# EAGLE design TopPCB (EAGLE 9.5.2)
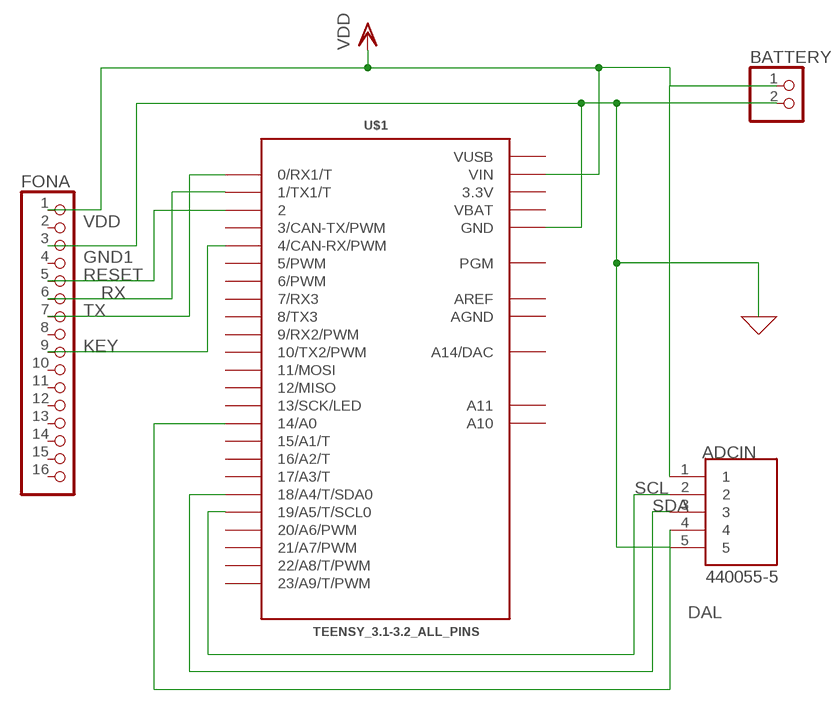
[diagram p0: schematic, sheet 1]

## Parts
ADCIN  440055-5  [TE_440055-5]
BATTERY  PINHD-1X2  [1X02]
FONA  HEADER-1X16ROUND  [1X16_ROUND]
U$1  TEENSY_3.1-3.2_ALL_PINS  [TEENSY_3.0-3.2&LC_ALL_PINS]

## Nets
DAL: ADCIN.4 U$1.14/A0
GND1: ADCIN.5 BATTERY.2 FONA.3 U$1.GND U$1.GND1(GND) ; supply symbol labelled GND
KEY: FONA.9 U$1.4(4/CAN-RX/PWM)
RESET: FONA.5 U$1.2
RX: FONA.6 U$1.1(1/TX1/T)
SCL: ADCIN.2 U$1.19/A5(19/A5/T/SCL0)
SDA: ADCIN.3 U$1.18/A4(18/A4/T/SDA0)
TX: FONA.7 U$1.0(0/RX1/T)
VDD: ADCIN.1 BATTERY.1 FONA.1 U$1.VIN
Unconnected: FONA.2 FONA.4 FONA.8 FONA.10 FONA.11 FONA.12 FONA.13 FONA.14 FONA.15 FONA.16 U$1.3(3/CAN-TX/PWM) U$1.5(5/PWM) U$1.6(6/PWM) U$1.7(7/RX3) U$1.8(8/TX3) U$1.9(9/RX2/PWM) U$1.10(10/TX2/PWM) U$1.11(11/MOSI) U$1.12(12/MISO) U$1.13(13/SCK/LED) U$1.15/A1(15/A1/T) U$1.16/A2(16/A2/T) U$1.17/A3(17/A3/T) U$1.20/A6(20/A6/PWM) U$1.21/A7(21/A7/PWM) U$1.22/A8(22/A8/T/PWM) U$1.23/A9(23/A9/T/PWM) U$1.A10 U$1.A11 U$1.PGM U$1.RESET/DAC(A14/DAC)

## Power pins joined to a net without a drawn wire
3.3V: U$1.3.3V U$1.3.3V1(3.3V)
AGND: U$1.AGND
AREF: U$1.AREF
VBAT: U$1.VBAT
VUSB: U$1.VUSB

## Library data of the parts
ADCIN = 440055-5:440055-5; MANUFACTURER: TE; PARTREV: R; STANDARD: Manufacturer Recommendations
BATTERY = pinhead:PINHD-1X2: PIN HEADER
FONA = microbuilder:HEADER-1X16: PIN HEADER
U$1 = Teensy_3_and_LC_Series_Boards_v1.4:TEENSY_3.1-3.2_ALL_PINS: Footprint for Teensy 3.1 or 3.2 board using all through-holes, i.e. the entire perimeter plus the 4 through-holes inboard (A10,A11,AREF, VUSB)

## Board
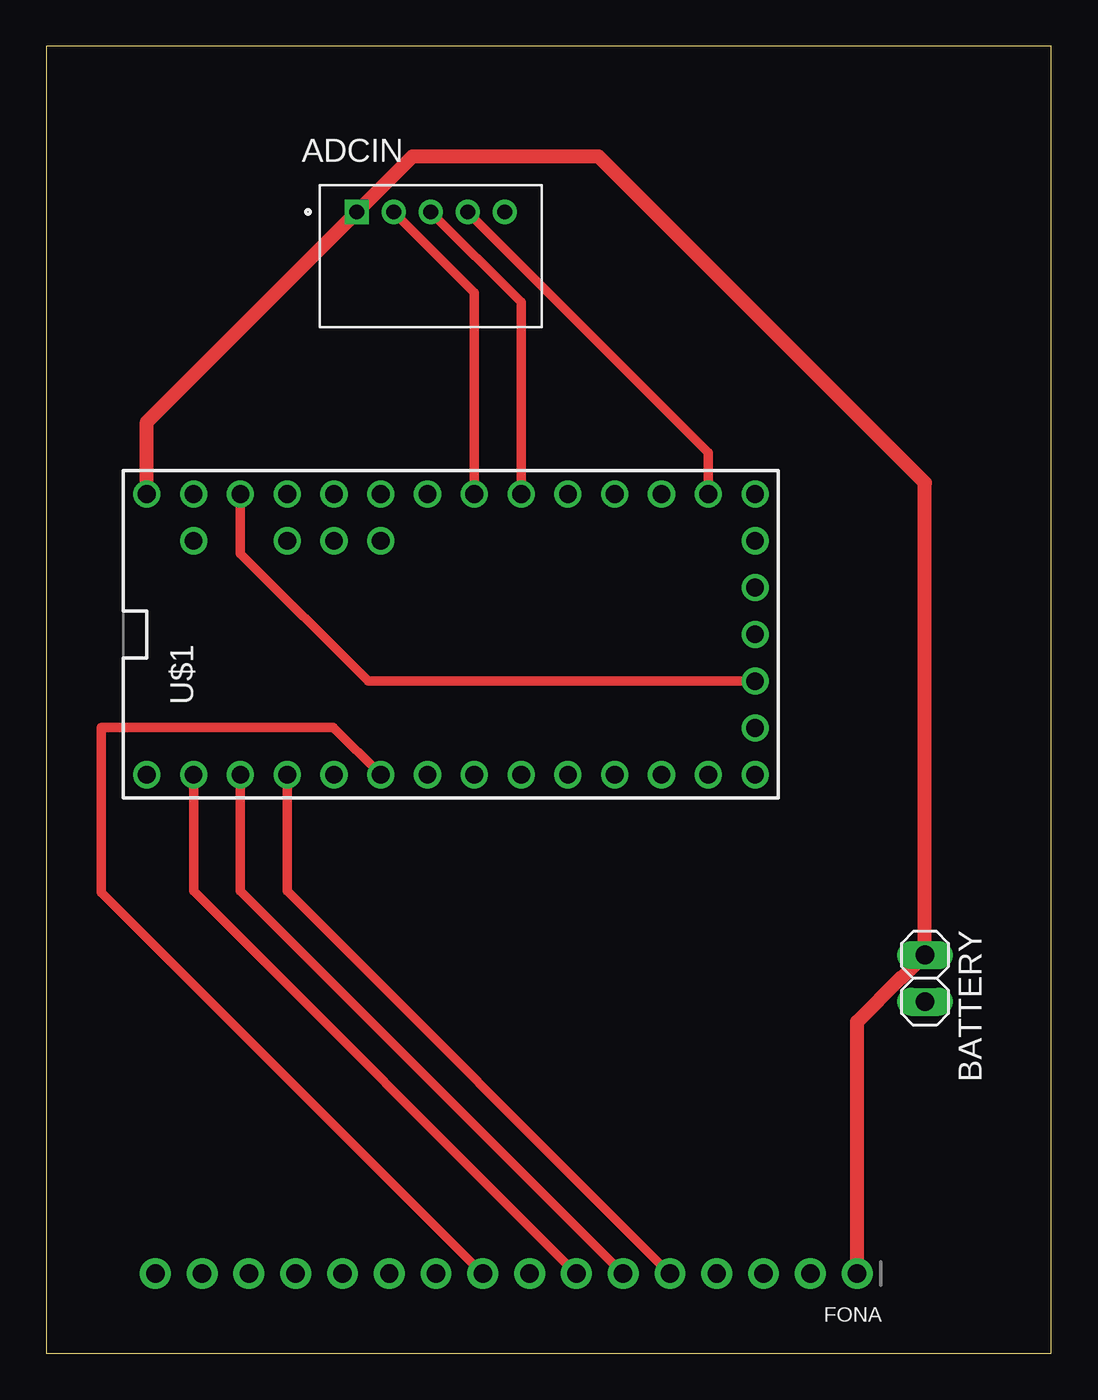
[diagram p1: board, top side]
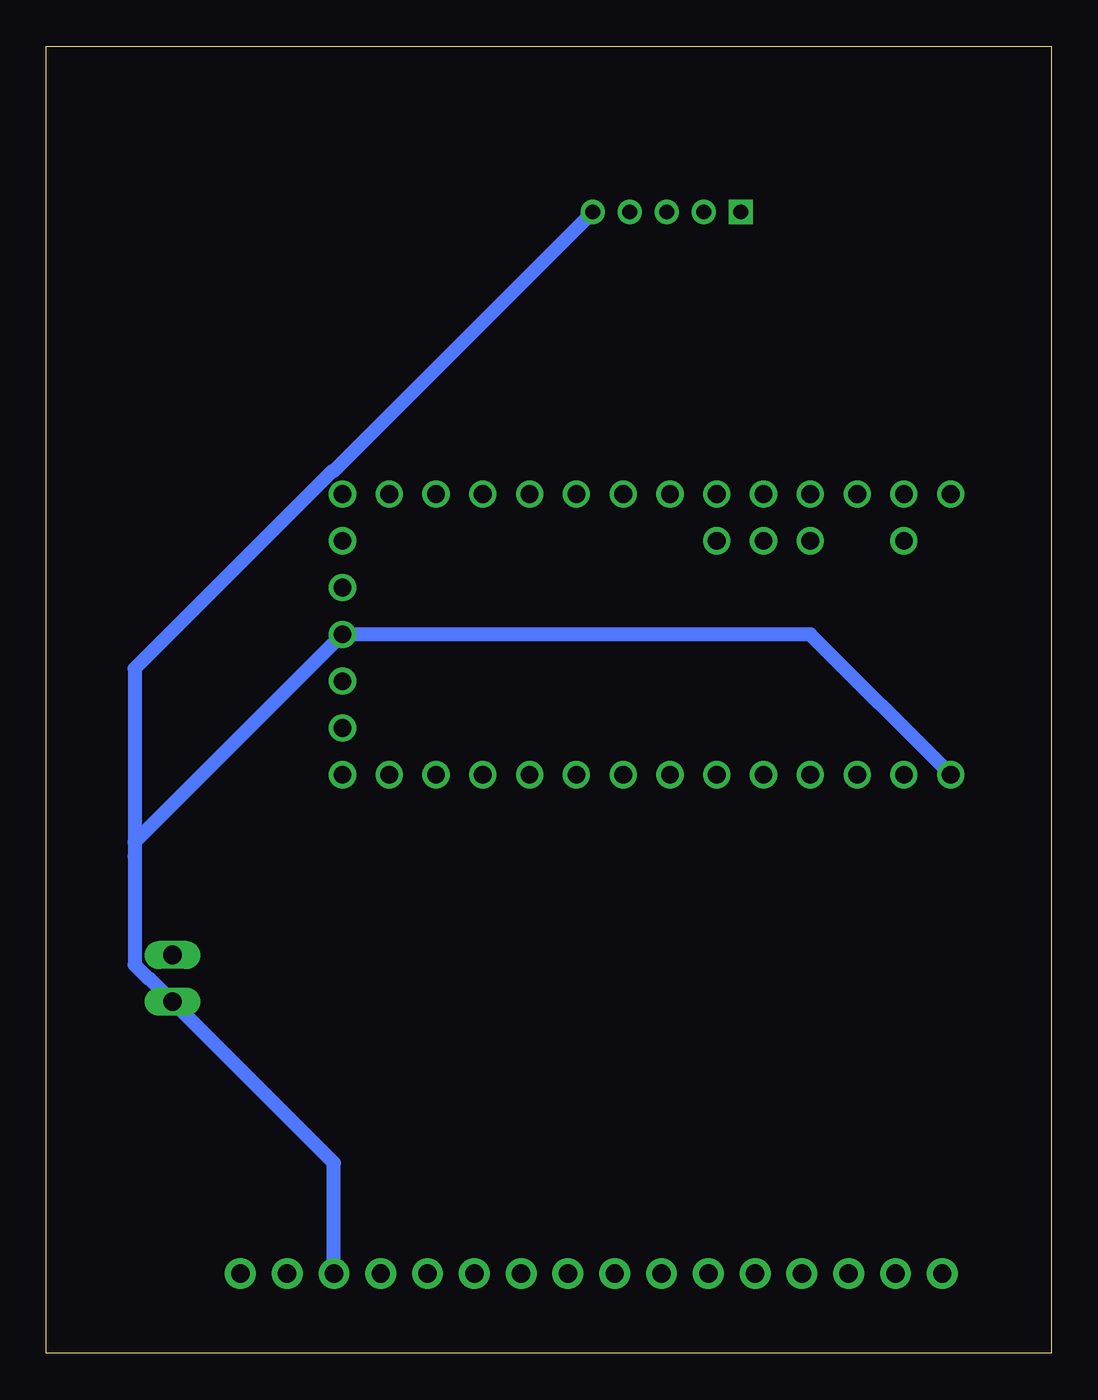
[diagram p2: board, bottom side, seen from below]

Size 54.58 x 71 mm. Coordinates in mm from the lower left corner, seen from the top.
Outline: 0,0 54.58,0 54.58,71 0,71 0,0
Copper layers (1*16): Top 0.035mm / dielectric 1.5mm / Bottom 0.035mm
Design rules "default": minimum track width 6mil, minimum drill 0.35mm, track to track 6mil, track to pad 6mil, pad to pad 6mil, via to via 6mil, smd to smd 6mil, copper to edge 40mil, drill to drill 6mil, minimum pad ring 10mil, minimum via ring 8mil, stop-mask expansion 4mil, vias tented up to drill 0mil, thermal gap 10mil

### Footprints (pad centres in the part's own frame; a part is rotated, then mirrored left to right if it is on the bottom)
TE_440055-5 = drill 0.8 pad 1.15 square: 1 0,0 | drill 0.8 pad 1.15: 2 2.007,0; 3 4.013,0; 4 6.02,0; 5 8.026,0
1X02 = drill 1.016 long: 1 -1.27,0; 2 1.27,0
1X16_ROUND = drill 1 pad 1.676: 1 -19.05,0; 2 -16.51,0; 3 -13.97,0; 4 -11.43,0; 5 -8.89,0; 6 -6.35,0; 7 -3.81,0; 8 -1.27,0; 9 1.27,0; 10 3.81,0; 11 6.35,0; 12 8.89,0; 13 11.43,0; 14 13.97,0; 15 16.51,0; 16 19.05,0
TEENSY_3.0-3.2&LC_ALL_PINS = drill 0.965: 0 -7.62,13.97; 1 -7.62,11.43; 2 -7.62,8.89; 3 -7.62,6.35; 3.3V 7.62,11.43; 3.3V1 -2.54,-16.51; 4 -7.62,3.81; 5 -7.62,1.27; 6 -7.62,-1.27; 7 -7.62,-3.81; 8 -7.62,-6.35; 9 -7.62,-8.89; 10 -7.62,-11.43; 11 -7.62,-13.97; 12 -7.62,-16.51; 13 7.62,-16.51; 14/A0 7.62,-13.97; 15/A1 7.62,-11.43; 16/A2 7.62,-8.89; 17/A3 7.62,-6.35; 18/A4 7.62,-3.81; 19/A5 7.62,-1.27; 20/A6 7.62,1.27; 21/A7 7.62,3.81; 22/A8 7.62,6.35; 23/A9 7.62,8.89; A10 5.08,6.35; A11 5.08,3.81; AGND 7.62,13.97; AREF 5.08,8.89; GND -7.62,16.51; GND1 0,-16.51; PGM 2.54,-16.51; RESET/DAC 5.08,-16.51; VBAT -5.08,-16.51; VIN 7.62,16.51; VUSB 5.08,13.97

### Placement (x,y rotation side)
ADCIN  16.87,61.99 0 top
BATTERY  47.71,20.37 270 top
FONA  24.98,4.34 180 top
U$1  21.98,39.05 90 top

### Tracks (layer width: path | path; a pad name or v marks a point on that pad's centre or on a via)
3.3V
  Top 0.508: U$1.3.3V1 17.49,36.51 10.55,43.45 U$1.3.3V
DAL
  Top 0.508: ADCIN.4 35.95,48.93 U$1.14/A0
GND1
  Bottom 0.762: FONA.3 38.95,10.34 BATTERY.2 48.95,20.34 49.01,20.34 49.77,21.1 49.77,27 49.77,27.77 | ADCIN.5 38.95,47.94 39.02,47.94 49.77,37.19 49.77,27.77 | U$1.GND 13.09,39.05 U$1.GND1 49.77,27.77
KEY
  Top 0.508: FONA.9 3,25.05 3,34 15.6,34 U$1.4
RESET
  Top 0.508: FONA.5 13.09,25.12 U$1.2
RX
  Top 0.508: FONA.6 10.55,25.12 U$1.1
SCL
  Top 0.508: ADCIN.2 23.25,57.62 U$1.19/A5
SDA
  Top 0.508: ADCIN.3 25.79,57.08 U$1.18/A4
TX
  Top 0.508: FONA.7 8.01,25.12 U$1.0
VDD
  Top 0.762: U$1.VIN 5.47,50.59 ADCIN.1 19.88,65 30,65 47.71,47.29 BATTERY.1 46.47,20.39 46.41,20.39 44.03,18.01 FONA.1